# Altium schematic sheet [01].PSU.SchDoc
size A4; Organization: Altium Limited; Address1: L3, 12a Rodborough Rd; Address2: Frenchs Forest; Address3: NSW; Address4: Australia 2086
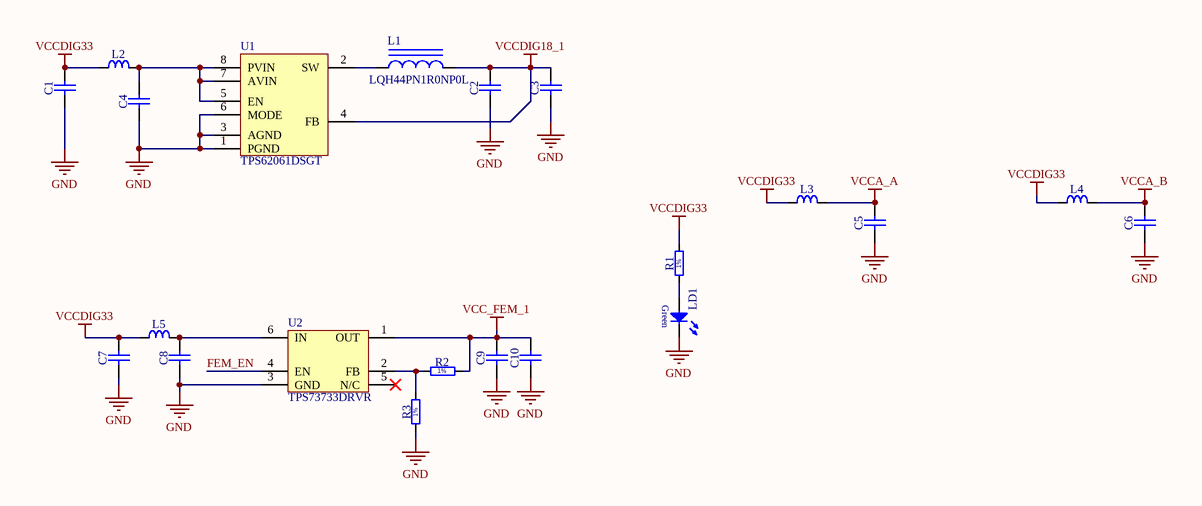
[diagram p0: [01].PSU.SchDoc]

## Parts
C1  1uF  [CAPC1005X55N]  (value not drawn)
C2  1uF  [CAPC1005X55N]  (value not drawn)
C3  1uF  [CAPC1005X55N]  (value not drawn)
C4  1uF  [CAPC1005X55N]  (value not drawn)
C5  1uF  [CAPC1005X55N]  (value not drawn)
C6  1uF  [CAPC1005X55N]  (value not drawn)
C7  1uF  [CAPC1005X55N]  (value not drawn)
C8  1uF  [CAPC1005X55N]  (value not drawn)
C9  1uF  [CAPC1005X55N]  (value not drawn)
C10  1uF  [CAPC1005X55N]  (value not drawn)
L1  LQH44PN1R0NP0L  [Inductor_1uH]
L2  600R@100MHz  [INDC1005X55N]  (value not drawn)
L3  600R@100MHz  [INDC1005X55N]  (value not drawn)
L4  600R@100MHz  [INDC1005X55N]  (value not drawn)
L5  600R@100MHz  [INDC1005X55N]  (value not drawn)
LD1  Green  [LED_OSRAM_LGL29K]  (value not drawn)
R1  470  [RESC1005X40N]  (value not drawn)
R2  10k  [RESC1005X40N]  (value not drawn)
R3  10k  [RESC1005X40N]  (value not drawn)
U1  TPS62061DSGT  [TPS62061]
U2  TPS73733DRVR  [TPS73733DRVR]

## Nets
GND: C1.1 C2.1 C3.1 C4.1 C5.1 C6.1 C7.1 C8.1 C9.1 C10.1 LD1.1(C) R3.1 U1.1(PGND) U1.3(AGND) U1.6(MODE) U2.3(GND)
VCC_FEM_1: C9.2 C10.2 R2.2 U2.1(OUT)
VCCA_A: C5.2 L3.2
VCCA_B: C6.2 L4.2
VCCDIG18_1: C2.2 C3.2 L1.2 U1.4(FB)
VCCDIG33: C1.2 C7.2 L2.1 L3.1 L4.1 L5.1 R1.2
FEM_EN: U2.4(EN)
NetC4_2: C4.2 L2.2 U1.5(EN) U1.7(AVIN) U1.8(PVIN)
NetC8_2: C8.2 L5.2 U2.6(IN)
NetL1_1: L1.1 U1.2(SW)
NetLD1_2: LD1.2(A) R1.1
NetR2_1: R2.1 R3.2 U2.2(FB)

Not connected (* = marked no-connect by the designer): U2 5(N/C)*

## Notes on the sheet
- Title
- Size:
- Date:
- A4
- Number:
- Time:
- Revision:
- Sheet
- of
- File:
- (in symbol R0402_10K_1%_0.0625W_100PPM) 1%
- (in symbol R0402_470R_1%_0.0625W_100PPM) 1%

## Library data of the parts
C1-C10 = CC0402_1UF_16V_10%_X5R: Non-polarised capacitor; Part Description: SMD Multilayer Chip Ceramic Capacitor; Manufacturer: GENERIC; Manufacturer1 Part Number: C1005X5R1C105KT; Voltage: 16V; TC: X5R; Tolerance: ±10%; Table: Capacitors SMD; Part Number: CC0402_1UF_16V_10%_X5R; Component Kind: Standard; Component Type: Standard; Pin Count: 2; Value: 1uF; Status: Preferred; Manufacturer Part Number: CC0402_1UF_16V_10%_X5R; Case: 0402; Mounted: Yes; Socket: No; SMD: Yes; Manufacturer1 Example: TDK; Manufacturer1 ComponentHeight: 0.55mm; HelpURL: \\cern.ch\dfs\Applications\Altium\Datasheets\CC0402_X5R_TDK_C.pdf; Author: CERN DEM JLC; CreateDate: 10/25/2012; LatestRevisionDate: 10/25/2012
L1 = Inductor: FIXED IND 1UH 2.45A 30 MOHM SMD; Manufacturer: Murata; Core Material: Ferrite; Tolerance: 30%; Max DC Current: 2.95A; Shielding: Shielded; Self Resonant Frequency: 90MHz; DC Resistance (DCR): 30mR; Test Frequency: 100kHz; Supplier 1: Digi-Key; Manufacturer Part Number: LQH44PN1R0NP0L; Stock 1: 14849; Pricing 1: 1 = 0.43000, 10 = 0.37900, 100 = 0.27080, 500 = 0.22750 (USD); RoHS: Yes; Mount: Surface Mount; Case/Package: 1515; Weight: 0.003527oz; Case Code (Metric): 4040; Case Code (Imperial): 1515; Min Operating Temperature: -40°C; Max Operating Temperature: 85°C; Inductance: 1uH; Package Quantity: 1000; Current Rating: 2.45A; Packaging: Tape and Reel; Inductance Tolerance: 30%; Saturation Current: 2.95A; Composition: Wirewound; Termination: SMD/SMT; DC Current: 2.45A; Military Standard: Not; Length: 4mm; Height: 0.9mm; Width: 0.157inch; Height - Seated (Max): 0.071inch; Depth: 4.2mm; Radiation Hardening: No; REACH SVHC: No SVHC; Lead Free: Lead Free; ComponentLink1URL: https://datasheet.ciiva.com/8002/490895-8002800.pdf?src-supplier=Element14; ComponentLink1Description: https://datasheet.ciiva.com/8002/490895-8002800.pdf?src-supplier=Element14; ComponentLink2URL: https://datasheet.ciiva.com/11798/0900766b81022890-11798663.pdf?src-supplier=RSComponents; ComponentLink2Description: https://datasheet.ciiva.com/11798/0900766b81022890-11798663.pdf?src-supplier=RSComponents; ComponentLink3URL: https://datasheet.ciiva.com/18090/getdatasheetpartid-200410-18090136.pdf?src-supplier=Verical; ComponentLink3Description: https://datasheet.ciiva.com/18090/getdatasheetpartid-200410-18090136.pdf?src-supplier=Verical; ComponentLink4URL: https://datasheet.ciiva.com/22732/490895-22732005.pdf?src-supplier=Element14; ComponentLink4Description: https://datasheet.ciiva.com/22732/490895-22732005.pdf?src-supplier=Element14; ComponentLink5URL: https://datasheet.ciiva.com/17277/l0075s0103lqh44p-p0-17277735.pdf?src-supplier=Avnet+Europe; ComponentLink5Description: https://datasheet.ciiva.com/17277/l0075s0103lqh44p-p0-17277735.pdf?src-supplier=Avnet+Europe; ComponentLink6URL: https://datasheet.ciiva.com/8506/l0075s0103lqh44p-p0-8506826.pdf?src-supplier=Avnet; ComponentLink6Description: https://datasheet.ciiva.com/8506/l0075s0103lqh44p-p0-8506826.pdf?src-supplier=Avnet; ComponentLink7URL: https://datasheet.ciiva.com/14124/lqh44pn-eng-ds-14124203.pdf?src-supplier=Distrelec; ComponentLink7Description: https://datasheet.ciiva.com/14124/lqh44pn-eng-ds-14124203.pdf?src-supplier=Distrelec; Supplier Part Number 1: 490-5325-1-ND
L2-L5 = IND0402_MURATA_BLM15HD601SN1: Inductor; Part Description: SMD EMIFIL Suppression Chip Ferrite Bead; Manufacturer: MURATA; Manufacturer Part Number: BLM15HD601SN1D; Power: 300mA; Resistance: 0.85R; Tolerance: ±25%; Table: Inductors SMD; Part Number: IND0402_MURATA_BLM15HD601SN1; Component Kind: Standard; Component Type: Standard; Pin Count: 2; Value: 600R@100MHz; Status: None; Case: 0402; Mounted: Yes; Socket: No; SMD: Yes; ComponentHeight: 0.55mm; HelpURL: \\cern.ch\dfs\Applications\Altium\Datasheets\IND0402_MURATA_BLM15H.pdf; Author: CERN DEM JLC; CreateDate: 2/28/2012; LatestRevisionDate: 2/28/2012
LD1 = LED_OSRAM_LG L29K-G2J1-24-Z: LED Green 1C 2A; Part Description: Surface Mount Green LED (0603 Case); Manufacturer: OSRAM; Table: LEDs & Displays; Part Number: LED_OSRAM_LG L29K-G2J1-24-Z; Component Kind: Standard; Component Type: Standard; Color: Green; PackageDescription: Green Chip LED, 2-Leads, Body 1.7x0.8mm, IPC Medium Density; Manufacturer Part Number: LG L29K-G2J1-24-Z; Pin Count: 2; Case: 0603; Mounted: Yes; Socket: No; SMD: Yes; ComponentHeight: 0.67mm; HelpURL: \\cern.ch\dfs\Applications\Altium\Datasheets\LED_OSRAM_LGL29K.pdf; Author: CERN DEM JLC; CreateDate: 4/24/2012; LatestRevisionDate: 4/24/2012
R1 = R0402_470R_1%_0.0625W_100PPM: Resistor - 1%; Part Description: General Purpose Thick Film Chip Resistor; Manufacturer: GENERIC; Manufacturer1 Part Number: 232270674701L; TC: ±100ppm/°C; Table: Resistors SMD; Part Number: R0402_470R_1%_0.0625W_100PPM; Component Kind: Standard; Component Type: Standard; Pin Count: 2; Value: 470; Status: Not recommended; Power: 0.0625W; Tolerance: ±1%; Manufacturer Part Number: R0402_470R_1%_0.0625W_100PPM; Case: 0402; Mounted: Yes; Socket: No; SMD: Yes; Manufacturer1 Example: YAGEO PHYCOMP; Manufacturer1 ComponentHeight: 0.4mm; HelpURL: \\cern.ch\dfs\Applications\Altium\Datasheets\R0402_Phycomp_RC0402.pdf; Author: CERN DEM JLC; CreateDate: 12/3/2007; LatestRevisionDate: 10/17/2012
R2 R3 = R0402_10K_1%_0.0625W_100PPM: Resistor - 1%; Part Description: General Purpose Thick Film Chip Resistor; Manufacturer: GENERIC; Manufacturer1 Part Number: 232270671003L; TC: ±100ppm/°C; Table: Resistors SMD; Part Number: R0402_10K_1%_0.0625W_100PPM; Component Kind: Standard; Component Type: Standard; Pin Count: 2; Value: 10k; Status: Not recommended; Power: 0.0625W; Tolerance: ±1%; Manufacturer Part Number: R0402_10K_1%_0.0625W_100PPM; Case: 0402; Mounted: Yes; Socket: No; SMD: Yes; Manufacturer1 Example: YAGEO PHYCOMP; Manufacturer1 ComponentHeight: 0.4mm; HelpURL: \\cern.ch\dfs\Applications\Altium\Datasheets\R0402_Phycomp_RC0402.pdf; Author: CERN DEM JLC; CreateDate: 12/3/2007; LatestRevisionDate: 10/17/2012
U1 = TPS62061: IC REG BUCK 1.8V 1.6A 8WSON; Manufacturer: Texas Instruments; Manufacturer Part Number: TPS62061DSGR; Switching Frequency: 3MHz; Number of Outputs: 1; Efficiency: 97%; Max Input Voltage: 6V; Min Input Voltage: 2.7V; Synchronous Rectifier: Yes; Quiescent Current: 18uA; Output Type: Fixed; Output Configuration: Positive; Supplier 1: Rochester Electronics; Stock 1: 8836; Pricing 1: 1 = 0.89000, 25 = 0.83000, 100 = 0.79000, 500 = 0.76000, 1000 = 0.72000 (USD); RoHS: Yes; Number of Pins: 8; Min Operating Temperature: -40°C; Max Operating Temperature: 85°C; Output Voltage: 1.8V; Output Current: 1.6A; Package Quantity: 3000; Packaging: Tape and Reel; Max Output Current: 1.6A; Min Output Voltage: 1.8V; Max Output Voltage: 1.8V; Lead Free: Lead Free; ComponentLink1URL: https://datasheet.ciiva.com/2034/tps62061-2034635.pdf?src-supplier=Digi-Key; ComponentLink1Description: https://datasheet.ciiva.com/2034/tps62061-2034635.pdf?src-supplier=Digi-Key; ComponentLink2URL: https://datasheet.ciiva.com/14377/tps62060-14377979.pdf?src-supplier=Avnet; ComponentLink2Description: https://datasheet.ciiva.com/14377/tps62060-14377979.pdf?src-supplier=Avnet; Supplier Part Number 1: TPS62061DSGR
U2 = TPS73733: IC REG LINEAR 3.3V 1A 6SON; Manufacturer: Texas Instruments; Number of Outputs: 1; Min Input Voltage: 2.2V; Max Input Voltage: 5.5V; Dropout Voltage: 130mV; Min Current Limit: 1.05A; Polarity: Positive; Accuracy: 1%; Power Supply Rejection Ratio (PSRR): 58dB; Quiescent Current: 400uA; Output Type: Fixed; Supplier 1: Digi-Key; Manufacturer Part Number: TPS73733DRVR; Stock 1: 15710; Pricing 1: 1 = 1.55000, 10 = 1.39200, 100 = 1.11890, 500 = 0.91928, 1000 = 0.76169 (USD); RoHS: Yes; Mount: Surface Mount; Number of Pins: 6; Contact Plating: Gold; Min Operating Temperature: -40°C; Max Operating Temperature: 125°C; Max Output Current: 1A; Output Voltage: 3.3V; Package Quantity: 3000; Packaging: Tape and Reel; Output Current: 1A; Number of Regulators: 1; Radiation Hardening: No; Lead Free: Lead Free; ComponentLink1URL: http://www.ti.com/lit/ds/symlink/tps73733.pdf?src-supplier=Avnet; ComponentLink1Description: http://www.ti.com/lit/ds/symlink/tps73733.pdf?src-supplier=Avnet; ComponentLink2URL: http://www.ti.com/lit/ds/symlink/tps737.pdf?src-supplier=Digi-Key; ComponentLink2Description: http://www.ti.com/lit/ds/symlink/tps737.pdf?src-supplier=Digi-Key; ComponentLink3URL: http://www.ti.com/lit/gpn/tps737?src-supplier=Mouser; ComponentLink3Description: http://www.ti.com/lit/gpn/tps737?src-supplier=Mouser; ComponentLink4URL: http://www.ti.com/general/docs/lit/getliterature.tsp?genericPartNumber=TPS737&&fileType=pdf&src-supplier=Avnet+Asia; ComponentLink4Description: http://www.ti.com/general/docs/lit/getliterature.tsp?genericPartNumber=TPS737&&fileType=pdf&src-supplier=Avnet+Asia; Supplier Part Number 1: 296-40960-1-ND